# EAGLE design feedback (EAGLE 9.3.0)
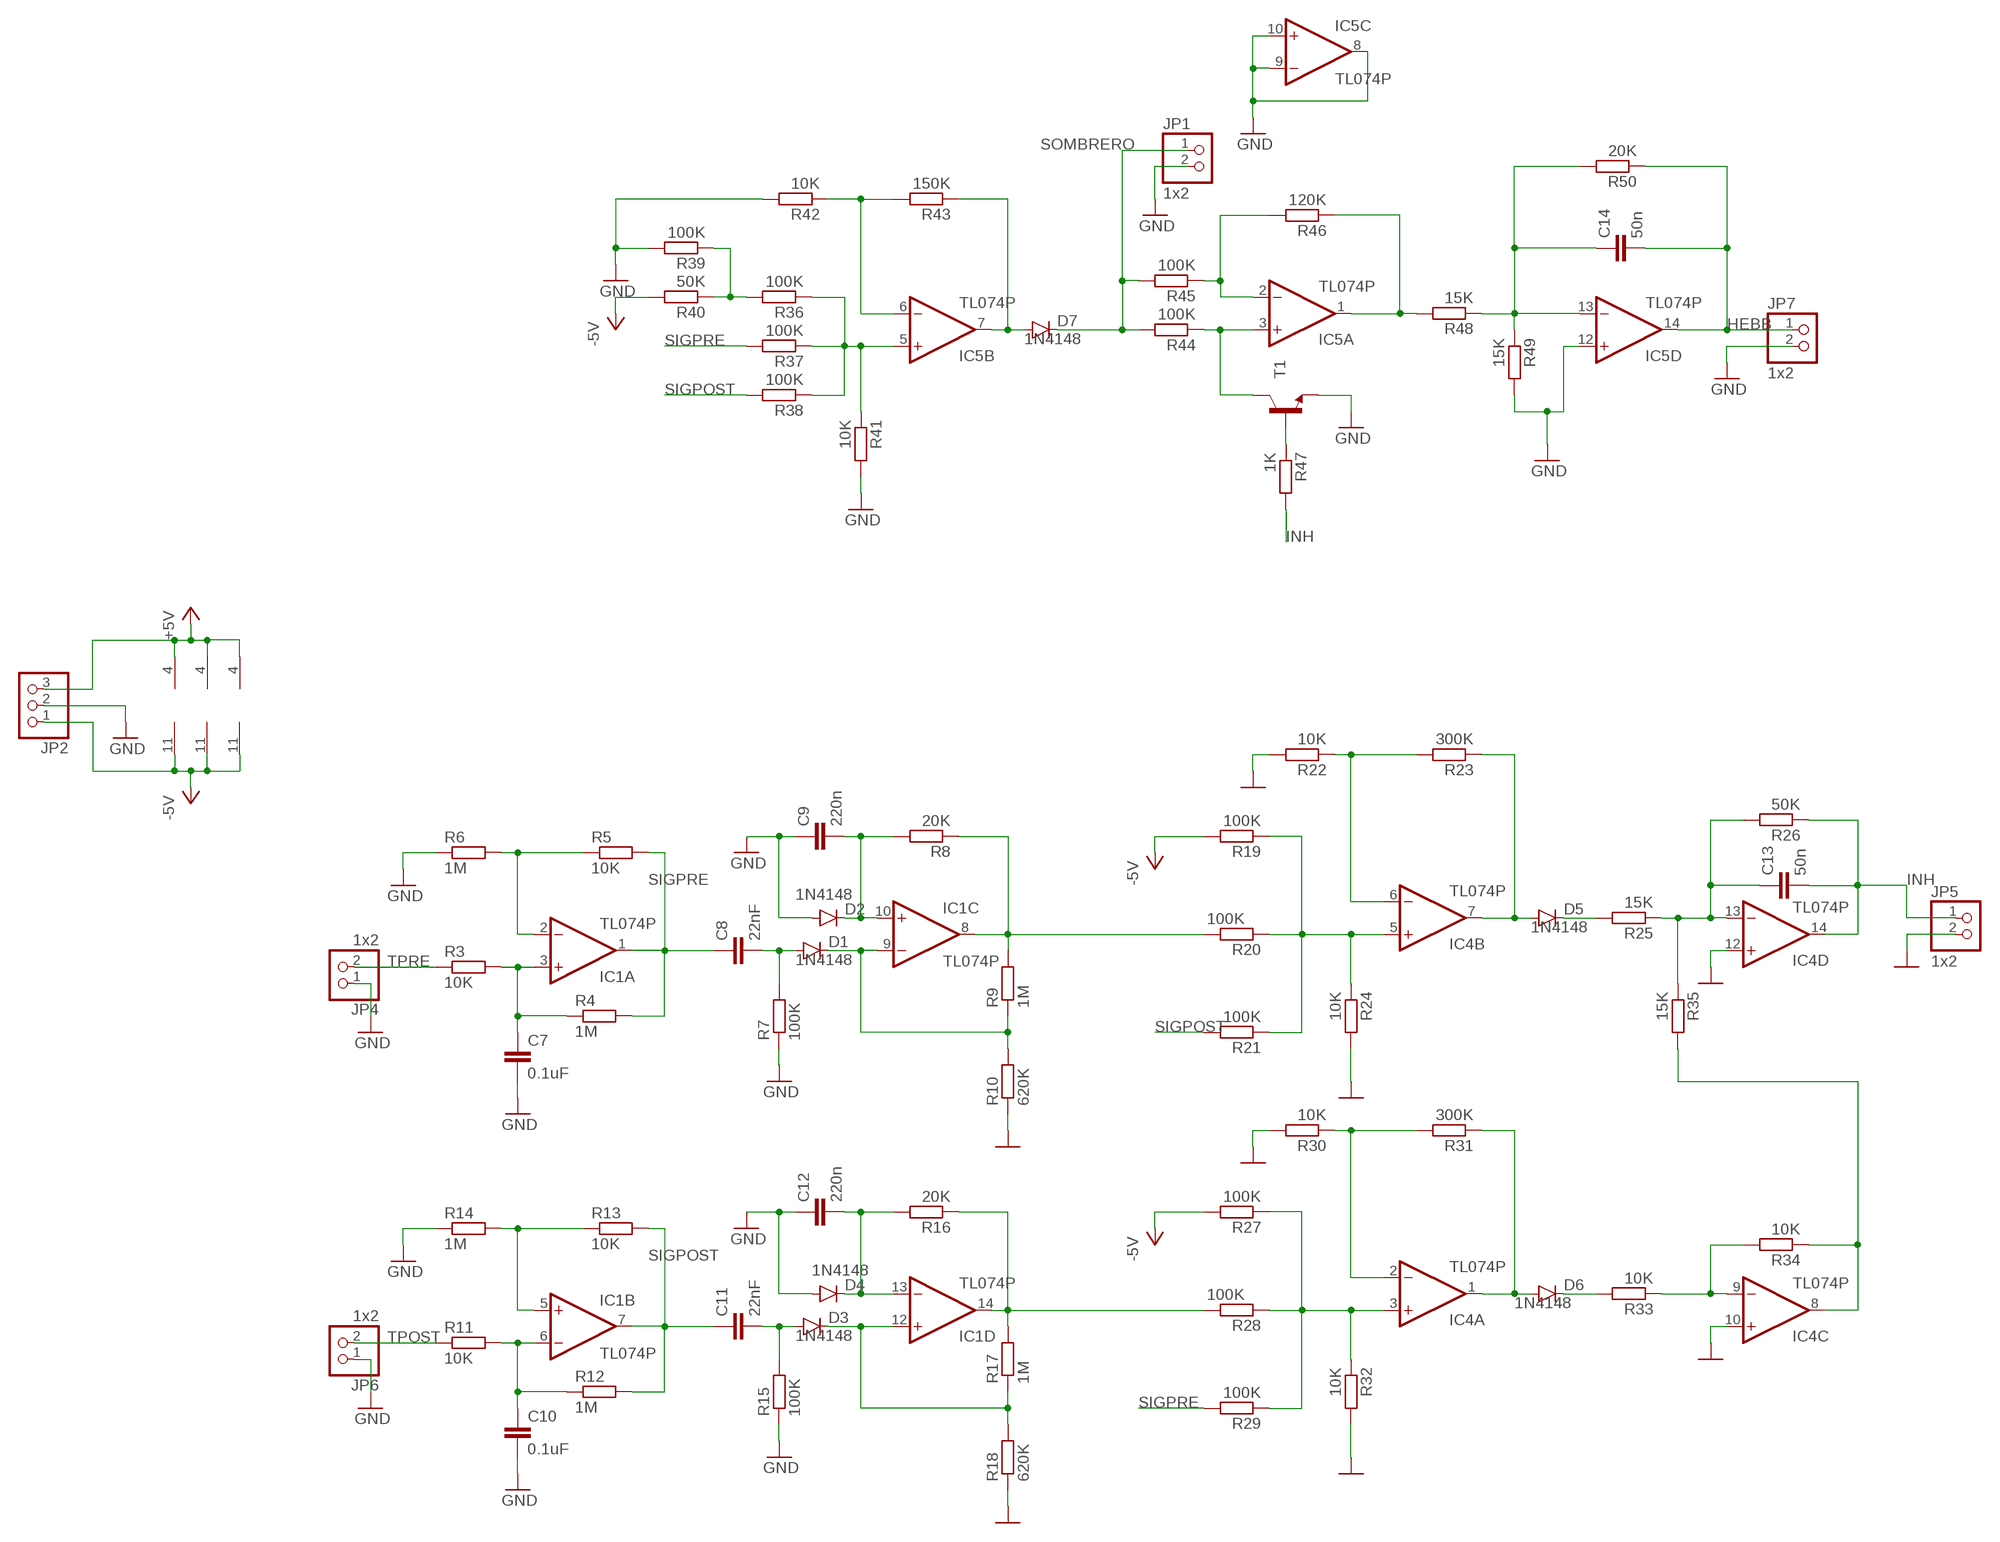
[diagram p0: schematic, sheet 1]

## Parts
C7  0.1uF  C-EU050-024X044  [C050-024X044]
C8  22nF  C-EU050-024X044  [C050-024X044]
C9  220n  C-EU050-024X044  [C050-024X044]
C10  0.1uF  C-EU050-024X044  [C050-024X044]
C11  22nF  C-EU050-024X044  [C050-024X044]
C12  220n  C-EU050-024X044  [C050-024X044]
C13  50n  C-EU050-024X044  [C050-024X044]
C14  50n  C-EU050-024X044  [C050-024X044]
D1  1N4148  DIODE1N4148  [DIODE-1N4148]
D2  1N4148  DIODE1N4148  [DIODE-1N4148]
D3  1N4148  DIODE1N4148  [DIODE-1N4148]
D4  1N4148  DIODE1N4148  [DIODE-1N4148]
D5  1N4148  DIODE1N4148  [DIODE-1N4148]
D6  1N4148  DIODE1N4148  [DIODE-1N4148]
D7  1N4148  DIODE1N4148  [DIODE-1N4148]
IC1  TL074P  [DIL14]
IC4  TL074P  [DIL14]
IC5  TL074P  [DIL14]
JP1  1x2  PINHD-1X2  [1X02]
JP2  PINHD-1X3  [1X03]
JP4  1x2  PINHD-1X2  [1X02]
JP5  1x2  PINHD-1X2  [1X02]
JP6  1x2  PINHD-1X2  [1X02]
JP7  1x2  PINHD-1X2  [1X02]
R3  10K  R-EU_0207/10  [0207/10]
R4  1M  R-EU_0207/10  [0207/10]
R5  10K  R-EU_0207/10  [0207/10]
R6  1M  R-EU_0207/10  [0207/10]
R7  100K  R-EU_0207/10  [0207/10]
R8  20K  R-EU_0207/10  [0207/10]
R9  1M  R-EU_0207/10  [0207/10]
R10  620K  R-EU_0207/10  [0207/10]
R11  10K  R-EU_0207/10  [0207/10]
R12  1M  R-EU_0207/10  [0207/10]
R13  10K  R-EU_0207/10  [0207/10]
R14  1M  R-EU_0207/10  [0207/10]
R15  100K  R-EU_0207/10  [0207/10]
R16  20K  R-EU_0207/10  [0207/10]
R17  1M  R-EU_0207/10  [0207/10]
R18  620K  R-EU_0207/10  [0207/10]
R19  100K  R-EU_0207/10  [0207/10]
R20  100K  R-EU_0207/10  [0207/10]
R21  100K  R-EU_0207/10  [0207/10]
R22  10K  R-EU_0207/10  [0207/10]
R23  300K  R-EU_0207/10  [0207/10]
R24  10K  R-EU_0207/10  [0207/10]
R25  15K  R-EU_0207/10  [0207/10]
R26  50K  R-EU_0207/10  [0207/10]
R27  100K  R-EU_0207/10  [0207/10]
R28  100K  R-EU_0207/10  [0207/10]
R29  100K  R-EU_0207/10  [0207/10]
R30  10K  R-EU_0207/10  [0207/10]
R31  300K  R-EU_0207/10  [0207/10]
R32  10K  R-EU_0207/10  [0207/10]
R33  10K  R-EU_0207/10  [0207/10]
R34  10K  R-EU_0207/10  [0207/10]
R35  15K  R-EU_0207/10  [0207/10]
R36  100K  R-EU_0207/10  [0207/10]
R37  100K  R-EU_0207/10  [0207/10]
R38  100K  R-EU_0207/10  [0207/10]
R39  100K  R-EU_0207/10  [0207/10]
R40  50K  R-EU_0207/10  [0207/10]
R41  10K  R-EU_0207/10  [0207/10]
R42  10K  R-EU_0207/10  [0207/10]
R43  150K  R-EU_0207/10  [0207/10]
R44  100K  R-EU_0207/10  [0207/10]
R45  100K  R-EU_0207/10  [0207/10]
R46  120K  R-EU_0207/10  [0207/10]
R47  1K  R-EU_0207/10  [0207/10]
R48  15K  R-EU_0207/10  [0207/10]
R49  15K  R-EU_0207/10  [0207/10]
R50  20K  R-EU_0207/10  [0207/10]
T1  BC337-25-NPN-TO92-CBE  [TO92-CBE]

## Nets
+5V: IC1.4(P:V+) IC4.4(P:V+) IC5.4(P:V+) JP2.3
-5V: IC1.11(P:V-) IC4.11(P:V-) IC5.11(P:V-) JP2.1 R19.2 R27.2 R40.2
GND: C7.2 C9.1 C10.2 C12.1 D2.A D4.A IC4.10(C:+IN) IC4.12(D:+IN) IC5.8(C:OUT) IC5.9(C:-IN) IC5.10(C:+IN) IC5.12(D:+IN) JP1.2 JP2.2 JP4.1 JP5.2 JP6.1 JP7.2 R6.1 R7.1 R10.1 R14.1 R15.1 R18.1 R22.2 R24.2 R30.2 R32.2 R39.2 R41.2 R42.2 R49.2 T1.E
HEBB [Signal]: C14.2 IC5.14(D:OUT) JP7.1 R50.1
INH [Signal]: C13.2 IC4.14(D:OUT) JP5.1 R26.1 R47.2
N$3 [Signal]: C7.1 IC1.3(A:+IN) R3.2 R4.1
N$6 [Signal]: IC5.5(B:+IN) R36.1 R37.1 R38.1 R41.1
N$7 [Signal]: IC4.5(B:+IN) R19.1 R20.1 R21.1 R24.1
N$8 [Signal]: IC1.2(A:-IN) R5.1 R6.2
N$9 [Signal]: C8.2 D1.A R7.2
N$10 [Signal]: C10.1 IC1.6(B:-IN) R11.2 R12.1
N$11 [Signal]: C9.2 D2.C IC1.10(C:+IN) R8.2
N$12 [Signal]: D1.C IC1.9(C:-IN) R9.1 R10.2
N$13 [Signal]: IC1.8(C:OUT) R8.1 R9.2 R20.2
N$14 [Signal]: R36.2 R39.1 R40.1
N$15 [Signal]: IC4.6(B:-IN) R22.1 R23.2
N$16 [Signal]: IC1.5(B:+IN) R13.1 R14.2
N$17 [Signal]: C11.2 D3.A R15.2
N$18 [Signal]: C12.2 D4.C IC1.13(D:-IN) R16.2
N$19 [Signal]: IC1.14(D:OUT) R16.1 R17.2 R28.2
N$20 [Signal]: D3.C IC1.12(D:+IN) R17.1 R18.2
N$21 [Signal]: D5.A IC4.7(B:OUT) R23.1
N$22 [Signal]: D5.C R25.2
N$23 [Signal]: C14.1 IC5.13(D:-IN) R48.1 R49.1 R50.2
N$24 [Signal]: C13.1 IC4.13(D:-IN) R25.1 R26.2 R35.1
N$26 [Signal]: IC4.3(A:+IN) R27.1 R28.1 R29.1 R32.1
N$27 [Signal]: IC5.6(B:-IN) R42.1 R43.2
N$28 [Signal]: D6.A IC4.1(A:OUT) R31.1
N$29 [Signal]: D6.C R33.2
N$30 [Signal]: IC4.9(C:-IN) R33.1 R34.2
N$31 [Signal]: IC4.8(C:OUT) R34.1 R35.2
N$32 [Signal]: IC4.2(A:-IN) R30.1 R31.2
N$33 [Signal]: D7.A IC5.7(B:OUT) R43.1
N$34 [Signal]: IC5.3(A:+IN) R44.1 T1.C
N$35 [Signal]: IC5.2(A:-IN) R45.1 R46.2
N$36 [Signal]: IC5.1(A:OUT) R46.1 R48.2
N$37 [Signal]: R47.1 T1.B
SIGPOST [Signal]: C11.1 IC1.7(B:OUT) R12.2 R13.2 R21.2 R38.2
SIGPRE [Signal]: C8.1 IC1.1(A:OUT) R4.2 R5.2 R29.2 R37.2
SOMBRERO [Signal]: D7.C JP1.1 R44.2 R45.2
TPOST [Signal]: JP6.2 R11.1
TPRE [Signal]: JP4.2 R3.1

## Library data of the parts
C7-C14 = resistor:C-EU: CAPACITOR, European symbol
D1-D7 = BeagleBone_Blue_R3:DIODE: Diode These are standard reverse protection diodes and small signal diodes. SMA package can handle up to about 1A. SOD-323 can handle about 200mA. What the SOD-323 package when ordering, there are some mfgs out there that are 5-pin packages.
IC1 IC4 IC5 = linear:TL074: OP AMP
JP1 JP4-JP7 = pinhead:PINHD-1X2: PIN HEADER
JP2 = pinhead:PINHD-1X3: PIN HEADER
R3-R50 = rcl:R-EU_: RESISTOR, European symbol; SPICEPREFIX: R
T1 = transistor:*-NPN-: NPN Transistror BF959 corrected 2008.03.06

## Net classes
0 Power: width 0.3 mm, drill 0.4 mm, clearance 0.7 mm
1 Signal: width 0.3 mm, drill 0.4 mm, clearance 0.7 mm to class 0, clearance 0.7 mm

## Board
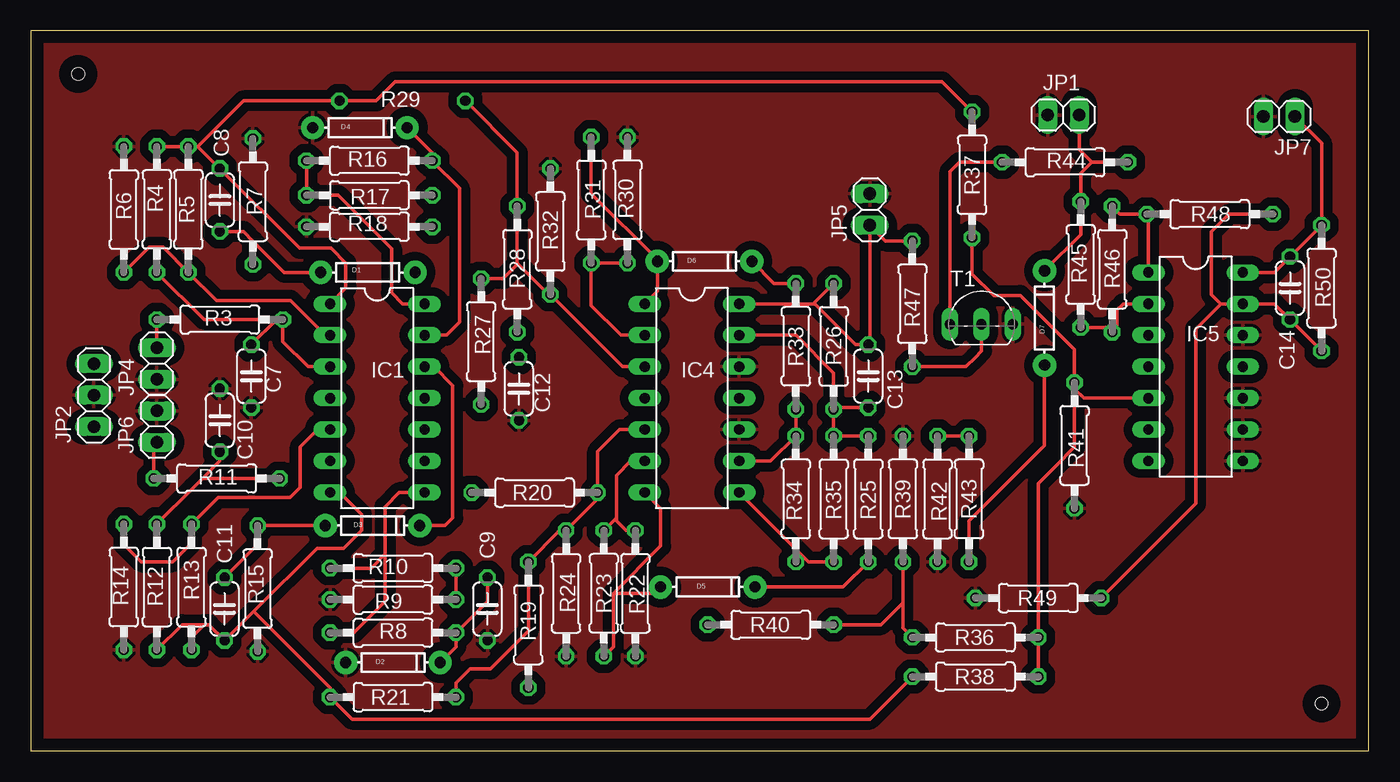
[diagram p1: board, top side]
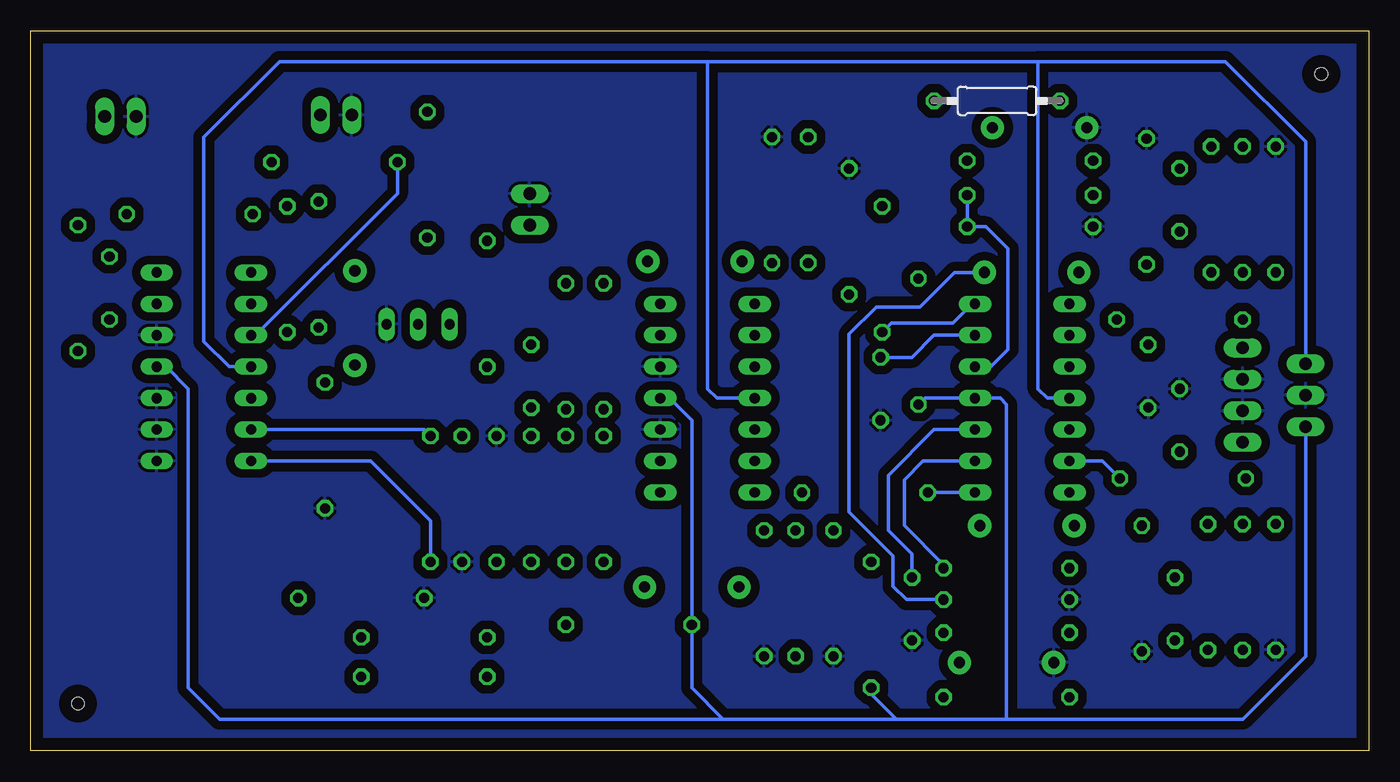
[diagram p2: board, bottom side, seen from below]

Size 107.93 x 58.09 mm. Coordinates in mm from the lower left corner, seen from the top.
Outline: 0,0 107.93,0 107.93,58.09 0,58.09 0,0
Copper layers (1*16): Top 0.035mm / dielectric 1.5mm / Bottom 0.035mm
Design rules "default": minimum track width 6mil, minimum drill 0.35mm, track to track 6mil, track to pad 6mil, pad to pad 6mil, via to via 6mil, smd to smd 6mil, copper to edge 40mil, drill to drill 6mil, minimum pad ring 10mil, minimum via ring 8mil, stop-mask expansion 4mil, vias tented up to drill 0mil, thermal gap 10mil
Holes 1 mm at 3.81,54.61 104.14,3.81

### Footprints (pad centres in the part's own frame; a part is rotated, then mirrored left to right if it is on the bottom)
C050-024X044 = drill 0.813 octagon: 1 -2.54,0; 2 2.54,0
DIODE-1N4148 = drill 0.9 pad 1.88: A -3.81,0; C 3.81,0
DIL14 = drill 0.813 long: 1 -7.62,-3.81; 2 -5.08,-3.81; 3 -2.54,-3.81; 4 0,-3.81; 5 2.54,-3.81; 6 5.08,-3.81; 7 7.62,-3.81; 8 7.62,3.81; 9 5.08,3.81; 10 2.54,3.81; 11 0,3.81; 12 -2.54,3.81; 13 -5.08,3.81; 14 -7.62,3.81
1X02 = drill 1.016 long: 1 -1.27,0; 2 1.27,0
1X03 = drill 1.016 long: 1 -2.54,0; 2 0,0; 3 2.54,0
0207/10 = drill 0.813 octagon: 1 -5.08,0; 2 5.08,0
TO92-CBE = drill 0.813 long: B 0,0; C -2.54,0; E 2.54,0

### Placement (x,y rotation side)
C7  17.78,30.23 270 top
C8  15.24,44.45 270 top
C9  36.83,11.43 90 top
C10  15.24,26.67 90 top
C11  15.62,11.43 90 top
C12  39.37,29.21 90 top
C13  67.56,30.23 90 top
C14  101.6,37.34 90 top
D1  27.18,38.61 0 top
D2  29.21,7.11 0 top
D3  27.56,18.16 0 top
D4  26.54,50.29 0 top
D5  54.61,13.21 0 top
D6  54.36,39.5 0 top
D7  81.79,34.92 90 top
IC1  27.94,28.45 270 top
IC4  53.34,28.45 270 top
IC5  93.98,30.99 270 top
JP1  83.31,51.31 180 top
JP2  5.08,28.7 90 top
JP4  10.16,31.24 90 top
JP5  67.69,43.69 90 top
JP6  10.16,26.16 270 top
JP7  100.71,51.18 180 top
R3  15.24,34.8 0 top
R4  10.16,43.69 90 top
R5  12.7,43.69 90 top
R6  7.49,43.69 270 top
R7  17.91,44.32 270 top
R8  29.21,9.53 0 top
R9  29.21,14.73 180 top
R10  29.21,12.19 0 top
R11  14.99,21.97 0 top
R12  10.16,13.21 270 top
R13  12.95,13.21 270 top
R14  7.49,13.21 90 top
R15  18.29,13.08 90 top
R16  27.3,47.62 0 top
R17  27.3,44.83 180 top
R18  27.3,42.29 0 top
R19  40.13,10.16 270 top
R20  40.64,20.83 180 top
R21  29.21,4.32 180 top
R22  48.77,12.7 270 top
R23  46.23,12.7 90 top
R24  43.18,12.7 270 top
R25  67.56,20.32 270 top
R26  64.77,32.64 270 top
R27  36.32,33.02 270 top
R28  39.24,38.86 270 top
R29  29.97,52.45 0 bottom
R30  48.13,44.45 90 top
R31  45.21,44.45 270 top
R32  41.91,41.91 90 top
R33  61.72,32.64 90 top
R34  61.72,20.32 90 top
R35  64.77,20.32 270 top
R36  76.2,9.14 180 top
R37  75.95,46.48 90 top
R38  76.2,5.97 180 top
R39  70.36,20.32 90 top
R40  59.69,10.16 180 top
R41  84.2,24.64 270 top
R42  73.15,20.32 270 top
R43  75.69,20.32 90 top
R44  83.44,47.5 0 top
R45  84.71,39.24 90 top
R46  87.25,38.86 270 top
R47  71.12,36.07 90 top
R48  95.12,43.31 180 top
R49  81.28,12.32 180 top
R50  104.14,37.34 270 top
T1  76.71,34.42 0 top

### Tracks (layer width: path | path; a pad name or v marks a point on that pad's centre or on a via)
+5V
  Bottom 0.3: JP2.3 5.08,49.15 11.56,55.63 26.67,55.63 | IC1.4 25.91,28.45 26.67,29.21 26.67,55.63 | IC4.4 52.58,28.45 53.34,29.21 53.34,55.63 | 53.34,55.63 26.67,55.63 | IC5.4 91.95,30.99 93.98,33.02 93.98,49.53 87.88,55.63 53.34,55.63
-5V
  Bottom 0.3: JP2.1 5.08,7.62 10.16,2.54 29.21,2.54 | 29.21,2.54 38.1,2.54 | 38.1,2.54 52.07,2.54 | 29.21,2.54 29.21,27.94 29.72,28.45 IC1.11 35.81,28.45 R27.2 | R19.2 40.13,4.57 38.1,2.54 | 52.07,2.54 54.61,5.08 R40.2 54.61,26.67 56.39,28.45 IC4.11 | 52.07,2.54 92.71,2.54 95.25,5.08 95.25,29.21 97.03,30.99 IC5.11
GND
  pour Bottom: -7.62,102.87 229.87,102.87 229.87,-1.27 -7.62,-1.27
  pour Top: -5.08,-3.81 -5.08,59.69 189.23,59.69 189.23,-3.81
HEBB
  Top 0.3: IC5.14 100.33,38.61 C14.2 R50.1 104.14,49.02 JP7.1
INH
  Top 0.3: IC4.14 63.12,36.07 | 63.12,36.07 63.25,36.07 66.55,32.77 C13.2 67.69,32.89 JP5.1 68.96,41.15 R47.2 | 63.12,36.07 R26.1
N$3
  Top 0.3: R4.1 13.97,34.8 R3.2 | C7.1 19.81,34.8 R3.2 | IC1.3 22.35,30.99 20.32,33.02 R3.2
N$6
  Top 0.3: R37.1 75.95,38.48 77.69,36.74 79.83,36.74 84.2,32.37 R41.1 84.2,29.21 | R38.1 R36.1 81.28,21.59 82.69,23 84.2,24.51 84.2,29.21 | IC5.5 84.96,28.45 84.2,29.21
N$7
  Top 0.3: R21.1 34.29,5.46 35.43,6.6 37.08,6.6 40.13,9.65 R19.1 42.67,17.78 R24.1 45.72,20.32 R20.1 45.72,24.13 47.5,25.91 IC4.5
N$8
  Top 0.3: R6.2 9.53,40.64 10.67,40.64 R5.1 14.97,36.34 20.94,36.34 23.75,33.53 IC1.2
N$9
  Top 0.3: R7.2 17.91,41.15 | 17.91,41.15 17.14,41.91 C8.2 | D1.A 20.45,38.61 17.91,41.15
N$10
  Top 0.3: R12.1 13.08,21.21 13.84,21.97 | 13.84,21.97 R11.2 | C10.1 15.24,23.37 13.84,21.97
  Bottom 0.3: R11.2 21.46,23.37 IC1.6
N$11
  Top 0.3: D2.C 34.29,8.38 R8.2 36.83,12.06 C9.2
  Bottom 0.3: C9.2 36.83,15.88 38.73,17.78 38.73,22.23 35.05,25.91 IC1.10
N$12
  Top 0.3: R9.1 R10.2
  Bottom 0.3: R9.1 34.29,14.99 37.47,18.16 37.47,21.84 35.94,23.37 IC1.9 | D1.C 33.4,38.61 36.19,35.83 39.7,35.83 41.91,33.62 41.91,19.27 38.37,15.72 38.37,13.26 37.3,12.19 R10.2
N$13
  Top 0.3: IC1.8 29.72,20.83 28.57,19.68 28.57,15.88 | R8.1 26.04,9.53 28.57,12.06 28.57,15.88 | R9.2 27.43,14.73 28.57,15.88
  Bottom 0.3: IC1.8 R20.2
N$14
  Top 0.3: R40.1 68.58,10.16 70.36,11.94 | 70.36,11.94 R39.1 | R36.2 70.36,9.91 70.36,11.94
N$15
  Top 0.3: 47.26,18.55 47.26,22.23 48.4,23.37 IC4.6 | R23.2 47.13,18.68 47.26,18.55 | 47.26,18.55 48.03,17.78 R22.1
N$16
  Top 0.3: R14.2 7.49,16.64 8.89,15.24 11.43,15.24 12.95,16.76 R13.1 15.1,20.43 20.9,20.43 21.73,21.26 21.73,24.52 23.11,25.91 IC1.5
N$17
  Top 0.3: C11.2 18.29,16.64 R15.2 D3.A
N$18
  Top 0.3: D4.C 32.38,48.26 R16.2 32.38,47.59 34.58,45.39 34.58,34.58 33.53,33.53 IC1.13
  Bottom 0.3: C12.2 36.83,31.75 35.05,33.53 IC1.13
N$19
  Top 0.3: R16.1 R17.2 24.77,44.83 29.08,40.51 29.08,36.96 29.97,36.07 IC1.14
  Bottom 0.3: R28.2 38.5,34.53 33.55,34.53 32.01,36.07 IC1.14
N$20
  Top 0.3: IC1.12 32.51,30.99 34.04,29.46 34.04,21.43 34.02,21.41 34.02,18.78 33.4,18.16 D3.C
  Bottom 0.3: R17.1 R18.2 30.86,42.29 29.08,40.51 29.08,32.38 30.48,30.99 IC1.12
N$21
  Top 0.3: R23.1 46.99,8.38 46.99,12.7 | IC4.7 50.8,19.56 50.8,16.51 46.99,12.7 | 46.99,12.7 50.29,12.7 D5.A
N$22
  Top 0.3: D5.C 65.53,13.21 R25.2
N$23
  Top 0.3: R50.2 C14.1 100.33,36.07 IC5.13 96.52,36.07 96.01,36.07 | R49.1 93.98,19.94 93.98,34.04 96.01,36.07 | R48.1 96.65,43.31 95.25,41.91 95.25,36.83 96.01,36.07
N$24
  Top 0.3: IC4.13 61.72,33.53 64.77,30.48 R26.2 | R26.2 R35.1 R25.1 | R26.2 64.9,27.69 C13.1
N$26
  Top 0.3: R29.1 39.24,48.26 R28.1 39.24,39.37 | 39.24,39.37 39.24,39.24 38.1,38.1 R27.1 | 39.24,39.37 41.78,36.83 R32.1 47.75,30.99 IC4.3
N$27
  Top 0.3: R42.1 R43.2
  Bottom 0.3: R43.2 76.2,25.91 IC5.6
N$28
  Top 0.3: R31.1 45.21,44.96 50.55,39.62 D6.A 50.55,37.08 IC4.1
N$29
  Top 0.3: D6.C 59.94,37.72 R33.2
N$30
  Top 0.3: R33.1 R34.2 59.69,23.37 IC4.9
N$31
  Top 0.3: IC4.8 61.21,16.76 61.72,16.26 | 61.72,16.26 R34.1 | 61.72,16.26 62.74,15.24 R35.2
N$32
  Top 0.3: R30.1 R31.2 45.21,35.94 47.62,33.53 IC4.2
N$33
  Top 0.3: R43.1 75.69,18.54 81.79,24.64 D7.A
  Bottom 0.3: IC5.7 80.52,23.37 75.69,18.54 R43.1
N$34
  Top 0.3: R44.1 74.93,47.5 74.17,46.74 T1.C
  Bottom 0.3: R44.1 78.36,44.97 89.8,33.53 IC5.3
N$35
  Top 0.3: IC5.2 88.14,36.07 87.63,35.56 87.63,34.16 | 87.63,34.16 R46.2 | R45.1 87.63,34.16
N$36
  Top 0.3: R46.1 87.88,43.31 R48.2 90.17,43.18 IC5.1
N$37
  Top 0.3: R47.1 75.44,30.99 76.2,31.75 76.71,32.26 T1.B
SIGPOST
  Top 0.3: R12.2 12.19,10.16 13.97,10.16 | 13.97,10.16 14.35,10.16 C11.1 17.97,11.24 | 17.97,11.24 23.07,16.34 25.23,16.34 26.67,17.78 26.67,19.05 24.89,20.83 IC1.7 | 17.97,11.24 24.13,5.08 R21.2 25.91,2.54 67.69,2.54 R38.2 | R13.2 12.95,9.14 13.97,10.16
SIGPRE
  Top 0.3: R4.2 R5.2 13.46,48.77 | 13.46,48.77 C8.1 21.68,40.55 24.22,40.55 25.4,39.37 25.4,37.34 IC1.1 | 13.46,48.77 17.14,52.45 R29.2 27.85,52.45 29.39,53.99 73.52,53.99 R37.2
SOMBRERO
  Top 0.3: D7.C 84.71,41.66 R45.2 84.71,46.61 85.6,47.5 | 85.6,47.5 R44.2 | 85.6,47.5 84.58,48.51 JP1.1
TPOST
  Top 0.3: JP6.2 9.91,24.64 R11.1
TPRE
  Top 0.3: JP4.2 R3.1